# Altium schematic sheet Lights.SchDoc: Top Level
size A3; CompanyName: NOT USED; DocumentNumber: 1; SheetNumber: 1; SheetTotal: 10; PageSetup: Record=PageOptions|CenterHorizontal=True|CenterVertical=True|PrintScale=1.00|XCorrection=1.00|YCorrection=1.00|PrintKind=0|BorderSize=5000000|LeftOffset=0|BottomOffset=0|Orientation=2|PaperLength=1000|PaperWidth=1000|Scale=100|PaperSource=7|PrintQuality=-4|MediaType=1|DitherType=10|PaperKind=A3|PrintScaleMode=0
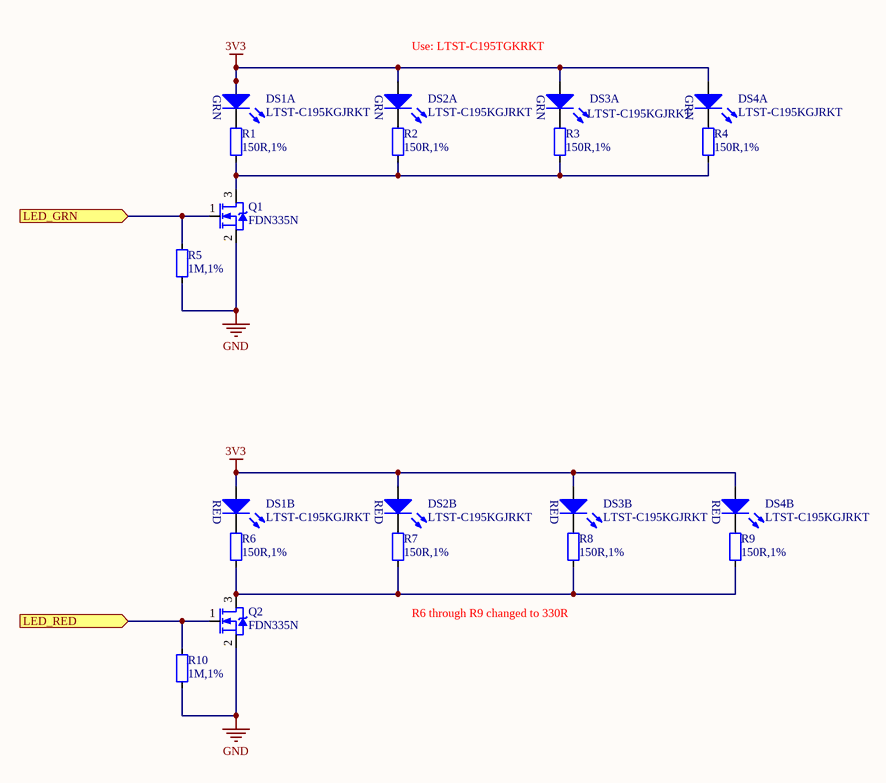
[diagram p0: Lights.SchDoc]

## Parts
DS1  LTST-C195KGJRKT  [LITEON_LTST-C195KGJRKT]  (parts A,B of 2)
DS2  LTST-C195KGJRKT  [LITEON_LTST-C195KGJRKT]  (parts A,B of 2)
DS3  LTST-C195KGJRKT  [LITEON_LTST-C195KGJRKT]  (parts A,B of 2)
DS4  LTST-C195KGJRKT  [LITEON_LTST-C195KGJRKT]  (parts A,B of 2)
Q1  FDN335N  [SOT95P230X110-3N_SOT23]
Q2  FDN335N  [SOT95P230X110-3N_SOT23]
R1  150R,1%  [RESC1608X06N_0603]
R2  150R,1%  [RESC1608X06N_0603]
R3  150R,1%  [RESC1608X06N_0603]
R4  150R,1%  [RESC1608X06N_0603]
R5  1M,1%  [RESC1608X06N_0603]
R6  150R,1%  [RESC1608X06N_0603]
R7  150R,1%  [RESC1608X06N_0603]
R8  150R,1%  [RESC1608X06N_0603]
R9  150R,1%  [RESC1608X06N_0603]
R10  1M,1%  [RESC1608X06N_0603]

## Ports
LED_GRN (in), LED_RED (in)

## Nets
3V3: DS1.1(AG) DS1.2(AR) DS2.1(AG) DS2.2(AR) DS3.1(AG) DS3.2(AR) DS4.1(AG) DS4.2(AR)
GND: Q1.2(S) Q2.2(S) R5.2 R10.2
LED_GRN: Q1.1(G) R5.1 ; port LED_GRN
LED_RED: Q2.1(G) R10.1 ; port LED_RED
NetDS1_3: DS1.3(CG) R1.2
NetDS1_4: DS1.4(CR) R6.2
NetDS2_3: DS2.3(CG) R2.2
NetDS2_4: DS2.4(CR) R7.2
NetDS3_3: DS3.3(CG) R3.2
NetDS3_4: DS3.4(CR) R8.2
NetDS4_3: DS4.3(CG) R4.2
NetDS4_4: DS4.4(CR) R9.2
NetQ1_3: Q1.3(D) R1.1 R2.1 R3.1 R4.1
NetQ2_3: Q2.3(D) R6.1 R7.1 R8.1 R9.1

## Notes on the sheet
- Use: LTST-C195TGKRKT
- R6 through R9 changed to 330R
- Project
- Size:
- Date:
- A3
- Revision:
- Sheet
- of
- Lambo
- File:
- (in symbol LED-10055-A, part A) GRN
- (in symbol LED-10055-A, part B) RED

## Library data of the parts
DS1-DS4 = LED-10055-A: LED GREEN/RED BICOLOR 0606 SMD; Manufacturer: Lite-On Inc; Wavelength: 571,631nm; Axial Intensity: 35,25mcd; Colour: Green,Red; If(max): 20mA; Lens type: Clear; Lens Style/Size: Rectangle with Flat Top, 1.5mm x 1.1mm; Vf@I: 2V,2V@20mA; Viewing Angle: 130°; Vr(max): 5V; Display_Name: LTST-C195KGJRKT; BWA PN: LED-10055-A; Schematic Symbol: LITEON_LTST-C195KGJRKT; Manufacturer Part Number: LTST-C195KGJRKT; Supplier 1: Digi-Key; Supplier Part Number 1: 160-1452-1-ND
Q1 Q2 = TRN-10045-A: MOSFET N-CH 20V 1.7A SSOT3; Manufacturer: Fairchild Semiconductor; Type: N; rds(on): 70mOhm; Vgs(max): +/-8V; Vth(max): 1.5V; Display_Name: FDN335N; BWA PN: TRN-10045-A; Id(max): 1.7A; Vds(max): 20V; Schematic Symbol: MOSFET-N_1; Manufacturer Part Number: FDN335N; Supplier 1: Digi-Key; Supplier Part Number 1: FDN335NCT-ND
R1-R4 R6-R9 = RSH-150R0-D: RES 150 OHM 1/10W 1% 0603 SMD; Manufacturer: Yageo; Manufacturer Part Number: RC0603FR-07150RL; Power: 0.1W; Display_Name: 150R,1%; Resistance: 150R; Tolerance: 1%; Type: Chip; BWA PN: RSH-150R0-D; Schematic Symbol: RESISTOR_1; Supplier 1: Digi-Key; Supplier Part Number 1: 311-150HRCT-ND
R5 R10 = RSH-1M000-D: RES 1.00M OHM 1/10W 1% 0603 SMD; Manufacturer: Yageo; Manufacturer Part Number: RC0603FR-071ML; Power: 0.1W; Display_Name: 1M,1%; Resistance: 1M; Tolerance: 1%; Type: Chip; BWA PN: RSH-1M000-D; Schematic Symbol: RESISTOR_1; Supplier 1: Digi-Key; Supplier Part Number 1: 311-1.00MHRCT-ND